# Altium project Analog _Line Follower 1.0.PrjPcb
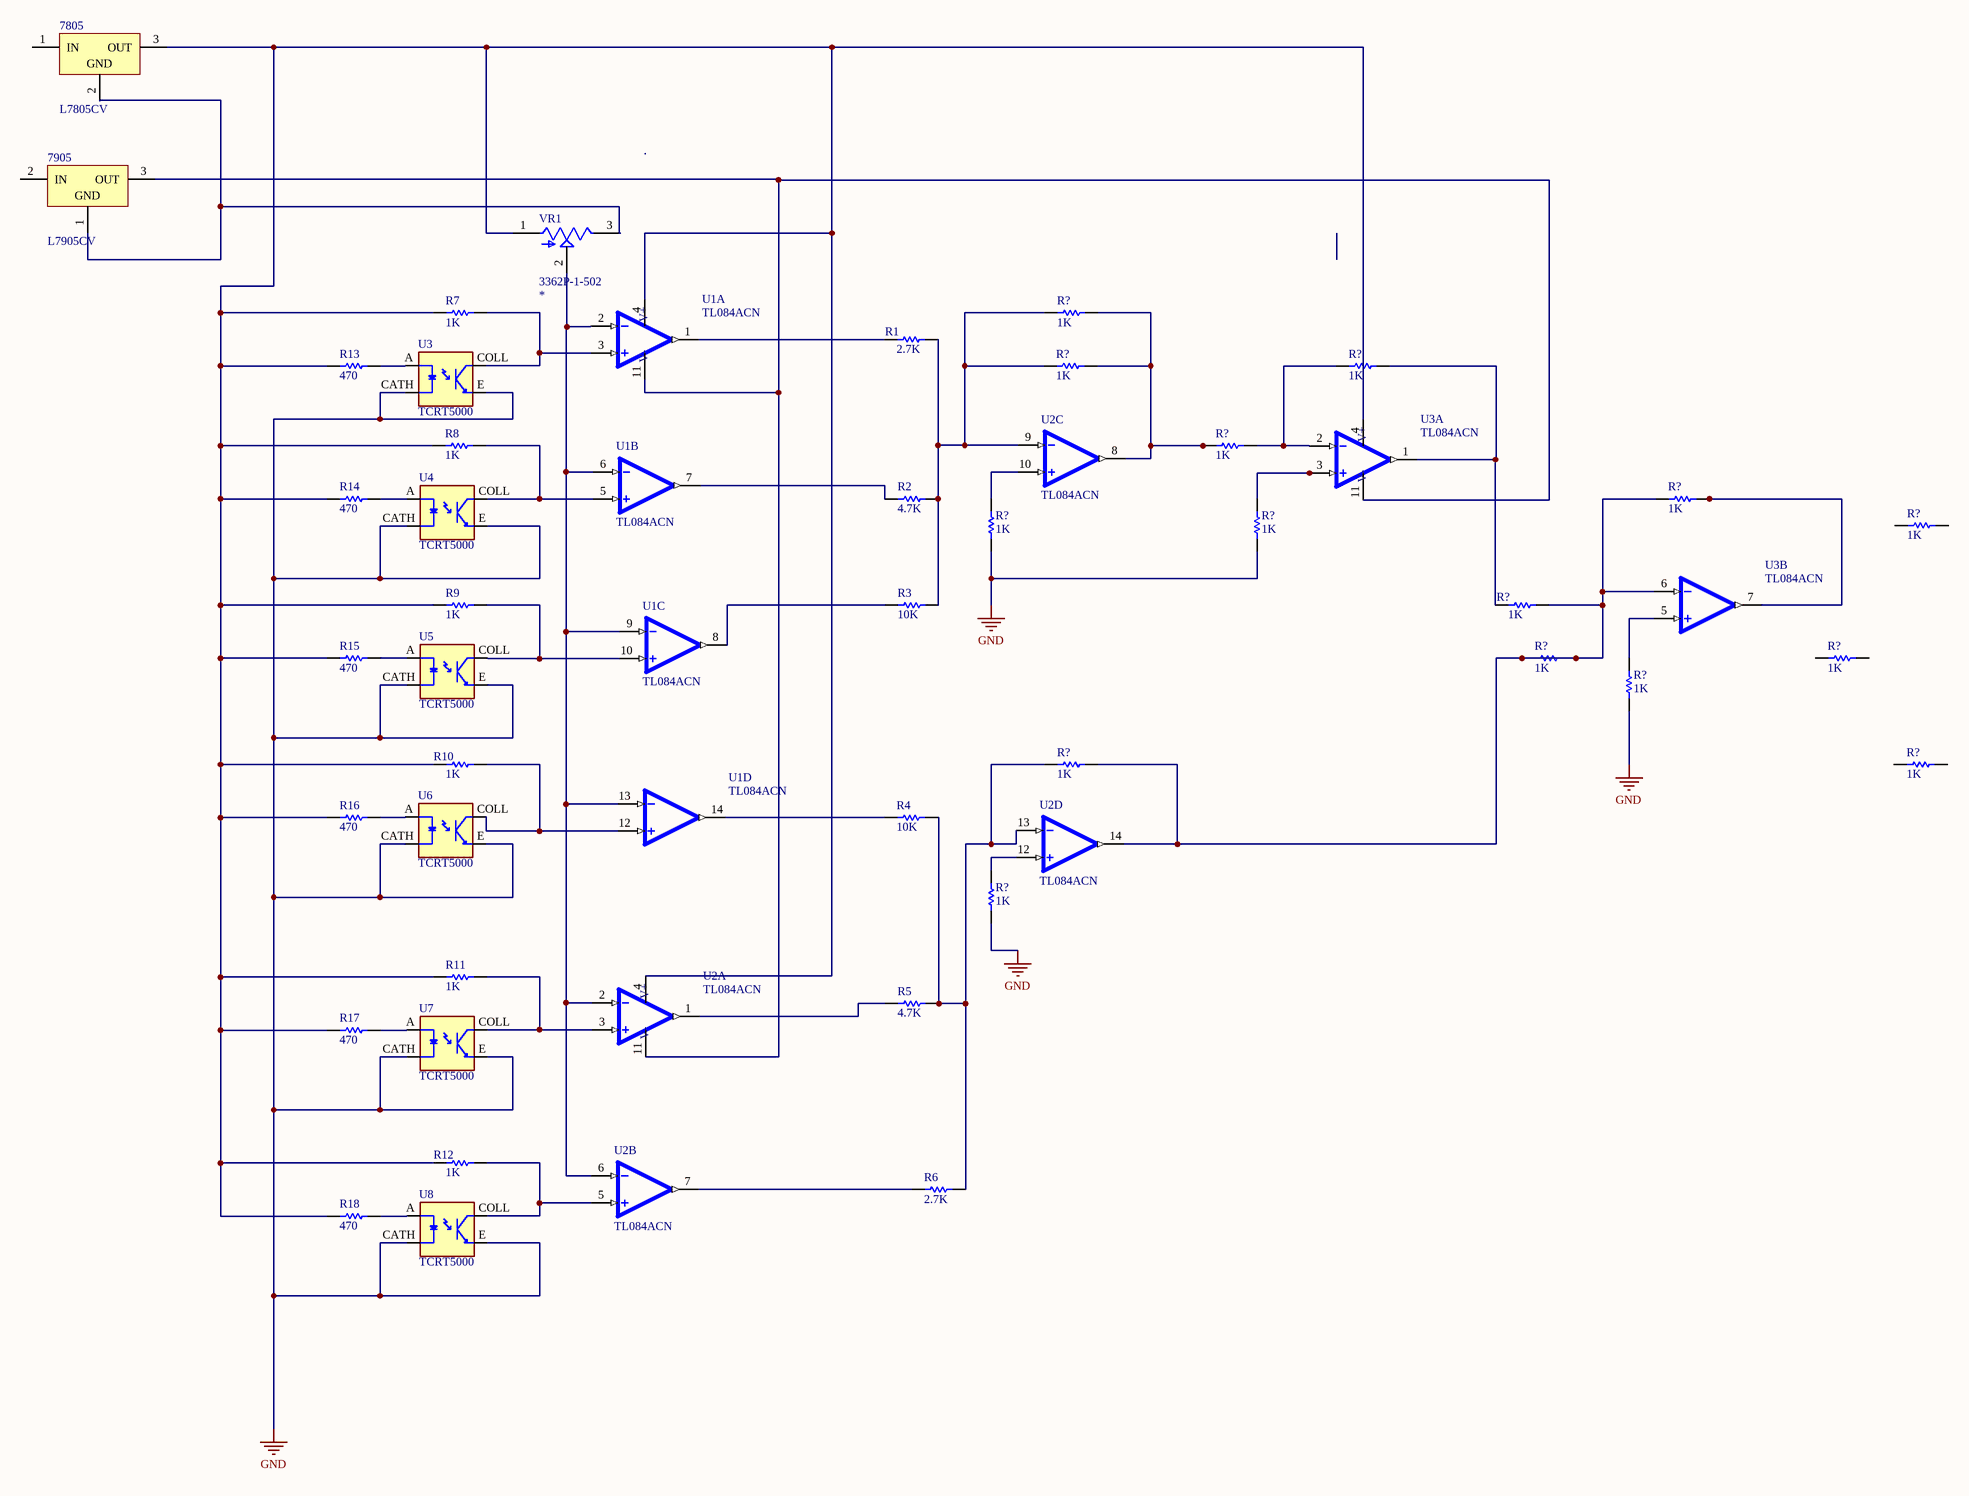
[diagram p0: Sheet1.SchDoc]
1 sheet, 45 parts. Net scope: global (net labels, ports and power ports of the same name join across sheets).
Board file: PCB1.PcbDoc

## Sheet Sheet1.SchDoc
size A2; SheetNumber: 1; SheetTotal: 2

### Parts
(Parts that share a designator on the sheet are numbered #1, #2 ... from top to bottom, then left to right.)
7805  L7805CV  [TO220]
7905  L7905CV  [TO-220]
R1  value 2.7K  (hidden comment: Resistor)
R2  value 4.7K  (hidden comment: Resistor)
R3  value 10K  (hidden comment: Resistor)
R4  value 10K  (hidden comment: Resistor)
R5  value 4.7K  (hidden comment: Resistor)
R6  value 2.7K  (hidden comment: Resistor)
R7  value 1K  (hidden comment: Resistor)
R8  value 1K  (hidden comment: Resistor)
R9  value 1K  (hidden comment: Resistor)
R10  value 1K  (hidden comment: Resistor)
R11  value 1K  (hidden comment: Resistor)
R12  value 1K  (hidden comment: Resistor)
R13  value 470  (hidden comment: Resistor)
R14  value 470  (hidden comment: Resistor)
R15  value 470  (hidden comment: Resistor)
R16  value 470  (hidden comment: Resistor)
R17  value 470  (hidden comment: Resistor)
R18  value 470  (hidden comment: Resistor)
R?#1  value 1K  (hidden comment: Resistor)
R?#2  value 1K  (hidden comment: Resistor)
R?#3  value 1K  (hidden comment: Resistor)
R?#4  value 1K  (hidden comment: Resistor)
R?#5  value 1K  (hidden comment: Resistor)
R?#6  value 1K  (hidden comment: Resistor)
R?#7  value 1K  (hidden comment: Resistor)
R?#8  value 1K  (hidden comment: Resistor)
R?#9  value 1K  (hidden comment: Resistor)
R?#10  value 1K  (hidden comment: Resistor)
R?#11  value 1K  (hidden comment: Resistor)
R?#12  value 1K  (hidden comment: Resistor)
R?#13  value 1K  (hidden comment: Resistor)
R?#14  value 1K  (hidden comment: Resistor)
R?#15  value 1K  (hidden comment: Resistor)
U1  TL084ACN  [DIP762W51P254L1954H508Q14]  (parts A,B,C,D of 4)
U2  TL084ACN  [DIP762W51P254L1954H508Q14]  (parts A,B,C,D of 4)
U3#1  TCRT5000  [OPTO_TCRT5000]
U3#2  TL084ACN  [DIP762W51P254L1954H508Q14]  (parts A,B of 4)
U4  TCRT5000  [OPTO_TCRT5000]
U5  TCRT5000  [OPTO_TCRT5000]
U6  TCRT5000  [OPTO_TCRT5000]
U7  TCRT5000  [OPTO_TCRT5000]
U8  TCRT5000  [OPTO_TCRT5000]
VR1  3362P-1-502  [TRIM_3362P-1-502]

### Nets
GND: R?#7.1 R?#8.1 R?#12.1 R?#15.1 U3#1.CATH U3#1.E U4.CATH U4.E U5.CATH U5.E U6.CATH U6.E U7.CATH U7.E U8.CATH U8.E
Net7805_2: 7805.2(GND) 7905.1(GND) VR1.3(CW)
Net7805_3: 7805.3(OUT) R7.1 R8.1 R9.1 R10.1 R11.1 R12.1 R13.1 R14.1 R15.1 R16.1 R17.1 R18.1 U1.4(VCC+) U2.4(VCC+) U3#2.4(VCC+) VR1.1(CCW)
Net7905_3: 7905.3(OUT) U1.11(VCC-) U2.11(VCC-) U3#2.11(VCC-)
NetR1_1: R1.1 U1.1(1OUT)
NetR1_2: R1.2 R2.2 R3.2 R?#1.1 R?#2.1 U2.9(3IN-)
NetR2_1: R2.1 U1.7(2OUT)
NetR3_1: R3.1 U1.8(3OUT)
NetR4_1: R4.1 U1.14(4OUT)
NetR4_2: R4.2 R5.2 R6.2 R?#13.1 U2.13(4IN-)
NetR5_1: R5.1 U2.1(1OUT)
NetR6_1: R6.1 U2.7(2OUT)
NetR7_2: R7.2 U1.3(1IN+) U3#1.COLL
NetR8_2: R8.2 U1.5(2IN+) U4.COLL
NetR9_2: R9.2 U1.10(3IN+) U5.COLL
NetR10_2: R10.2 U1.12(4IN+) U6.COLL
NetR11_2: R11.2 U2.3(1IN+) U7.COLL
NetR12_2: R12.2 U2.5(2IN+) U8.COLL
NetR13_2: R13.2 U3#1.A
NetR14_2: R14.2 U4.A
NetR15_2: R15.2 U5.A
NetR16_2: R16.2 U6.A
NetR17_2: R17.2 U7.A
NetR18_2: R18.2 U8.A
NetR?#1_2: R?#1.2 R?#2.2 R?#4.1 U2.8(3OUT)
NetR?#3_1: R?#3.1 R?#4.2 U3#2.2(1IN-)
NetR?#3_2: R?#3.2 R?#9.1 U3#2.1(1OUT)
NetR?#5_1: R?#5.1 R?#9.2 R?#10.1 R?#10.2 R?#13.2 U2.14(4OUT) U3#2.6(2IN-)
NetR?#5_2: R?#5.2 U3#2.7(2OUT)
NetR?#7_2: R?#7.2 U2.10(3IN+)
NetR?#8_2: R?#8.2 U3#2.3(1IN+)
NetR?#12_2: R?#12.2 U3#2.5(2IN+)
NetR?#15_2: R?#15.2 U2.12(4IN+)
NetU1_2: U1.2(1IN-) U1.6(2IN-) U1.9(3IN-) U1.13(4IN-) U2.2(1IN-) U2.6(2IN-) VR1.2(WIPER)

Not connected (* = marked no-connect by the designer): 7805 1(IN); 7905 2(IN); R?#6 1 2; R?#11 1 2; R?#14 1 2

### Notes on the sheet
- (in symbol TL084ACN, part A) V+; V-

### Library data of the parts
7805 = CMP-0244-00483-1: Positive Voltage Regulator, 5V, 3-Pin TO-220; PackageDescription: TO, Thru-Hole, Vertical, Heatsink Mounted; 3 In-Line Leads; Pitch 2.54 mm; ComponentLink2Description: Datasheet; PackageReference: TO220; ComponentLink3URL: http://www.st.com/internet/com/TECHNICAL_RESOURCES/TECHNICAL_LITERATURE/PACKAGE_INFORMATION/CD00004649.pdf; DatasheetVersion: 16/11/2011; ComponentLink1Description: Manufacturer URL; ComponentLink1URL: http://www.st.com; PackageVersion: ver3.0; ComponentLink3Description: Package Specification; ComponentLink2URL: http://www.st.com/internet/com/TECHNICAL_RESOURCES/TECHNICAL_LITERATURE/DATASHEET/CD00000444.pdf
7905 = CMP-0244-00447-1: Negative Voltage Regulator, -5V, 3-Pin TO-220; ComponentLink2Description: Datasheet; DatasheetVersion: 1/11/2011; ComponentLink2URL: http://www.st.com/internet/com/TECHNICAL_RESOURCES/TECHNICAL_LITERATURE/DATASHEET/CD00000450.pdf; ComponentLink1Description: Manufacturer URL; PackageDescription: TO, Thru-Hole, Vertical, Heatsink Mounted; 3 In-Line Leads; Pitch 2.54 mm; ComponentLink1URL: http://www.st.com; PackageReference: TO-220; PackageVersion: 2011
R1-R18 R?#1-R?#15 = Resistor: TC1: 0; SimulationGenericComponent: True; TC2: 0
U1 U2 U3#2 = TL084ACN: Quad, 30-V, 3-MHz, 13-V/Âµs slew rate, 6-mV offset voltage, In to V+, JFET-input op amp; MF: Texas Instruments; SnapEDA_Link: https://www.snapeda.com/parts/TL084ACN/Texas+Instruments/view-part/?ref=snap; Package: PDIP-14 Texas Instruments; Availability: In Stock; Price: None; Purchase-URL: https://pricing.snapeda.com/search/part/TL084ACN/?ref=eda; Check_prices: https://www.snapeda.com/parts/TL084ACN/Texas+Instruments/view-part/?ref=eda; MP: TL084ACN; Value: *
U3#1 U4-U8 = TCRT5000: 950 nm 60 mA Through Hole Reflective Optical Sensor with Transistor Output; Availability: Unavailable; MP: TCRT5000; Value: *; Price: None; Package: None
VR1 = 3362P-1-502: 5 kOhms 0.5W, 1/2W PC Pins Through Hole Trimmer Potentiometer Cermet 1 Turn Top Adjustment; MF: Bourns; MP: 3362P-1-502; Purchase-URL: https://pricing.snapeda.com/search/part/3362P-1-502/?ref=eda; Availability: Warning; Package: 2220 Bourns; Price: None; Check_prices: https://www.snapeda.com/parts/3362P-1-502/Bourns/view-part/1463241/?ref=eda; Value: *; SnapEDA_Link: https://www.snapeda.com/parts/3362P-1-502/Bourns/view-part/1463241/?ref=snap